# EasyEDA schematic SCH_EVTY_2024-05-09.json
TITLE: EVTY_V1; REV: 1.0; Date: 2024-05-09; Sheet: 1/1; Drawn By: M Aitesam; Company: Tachyon
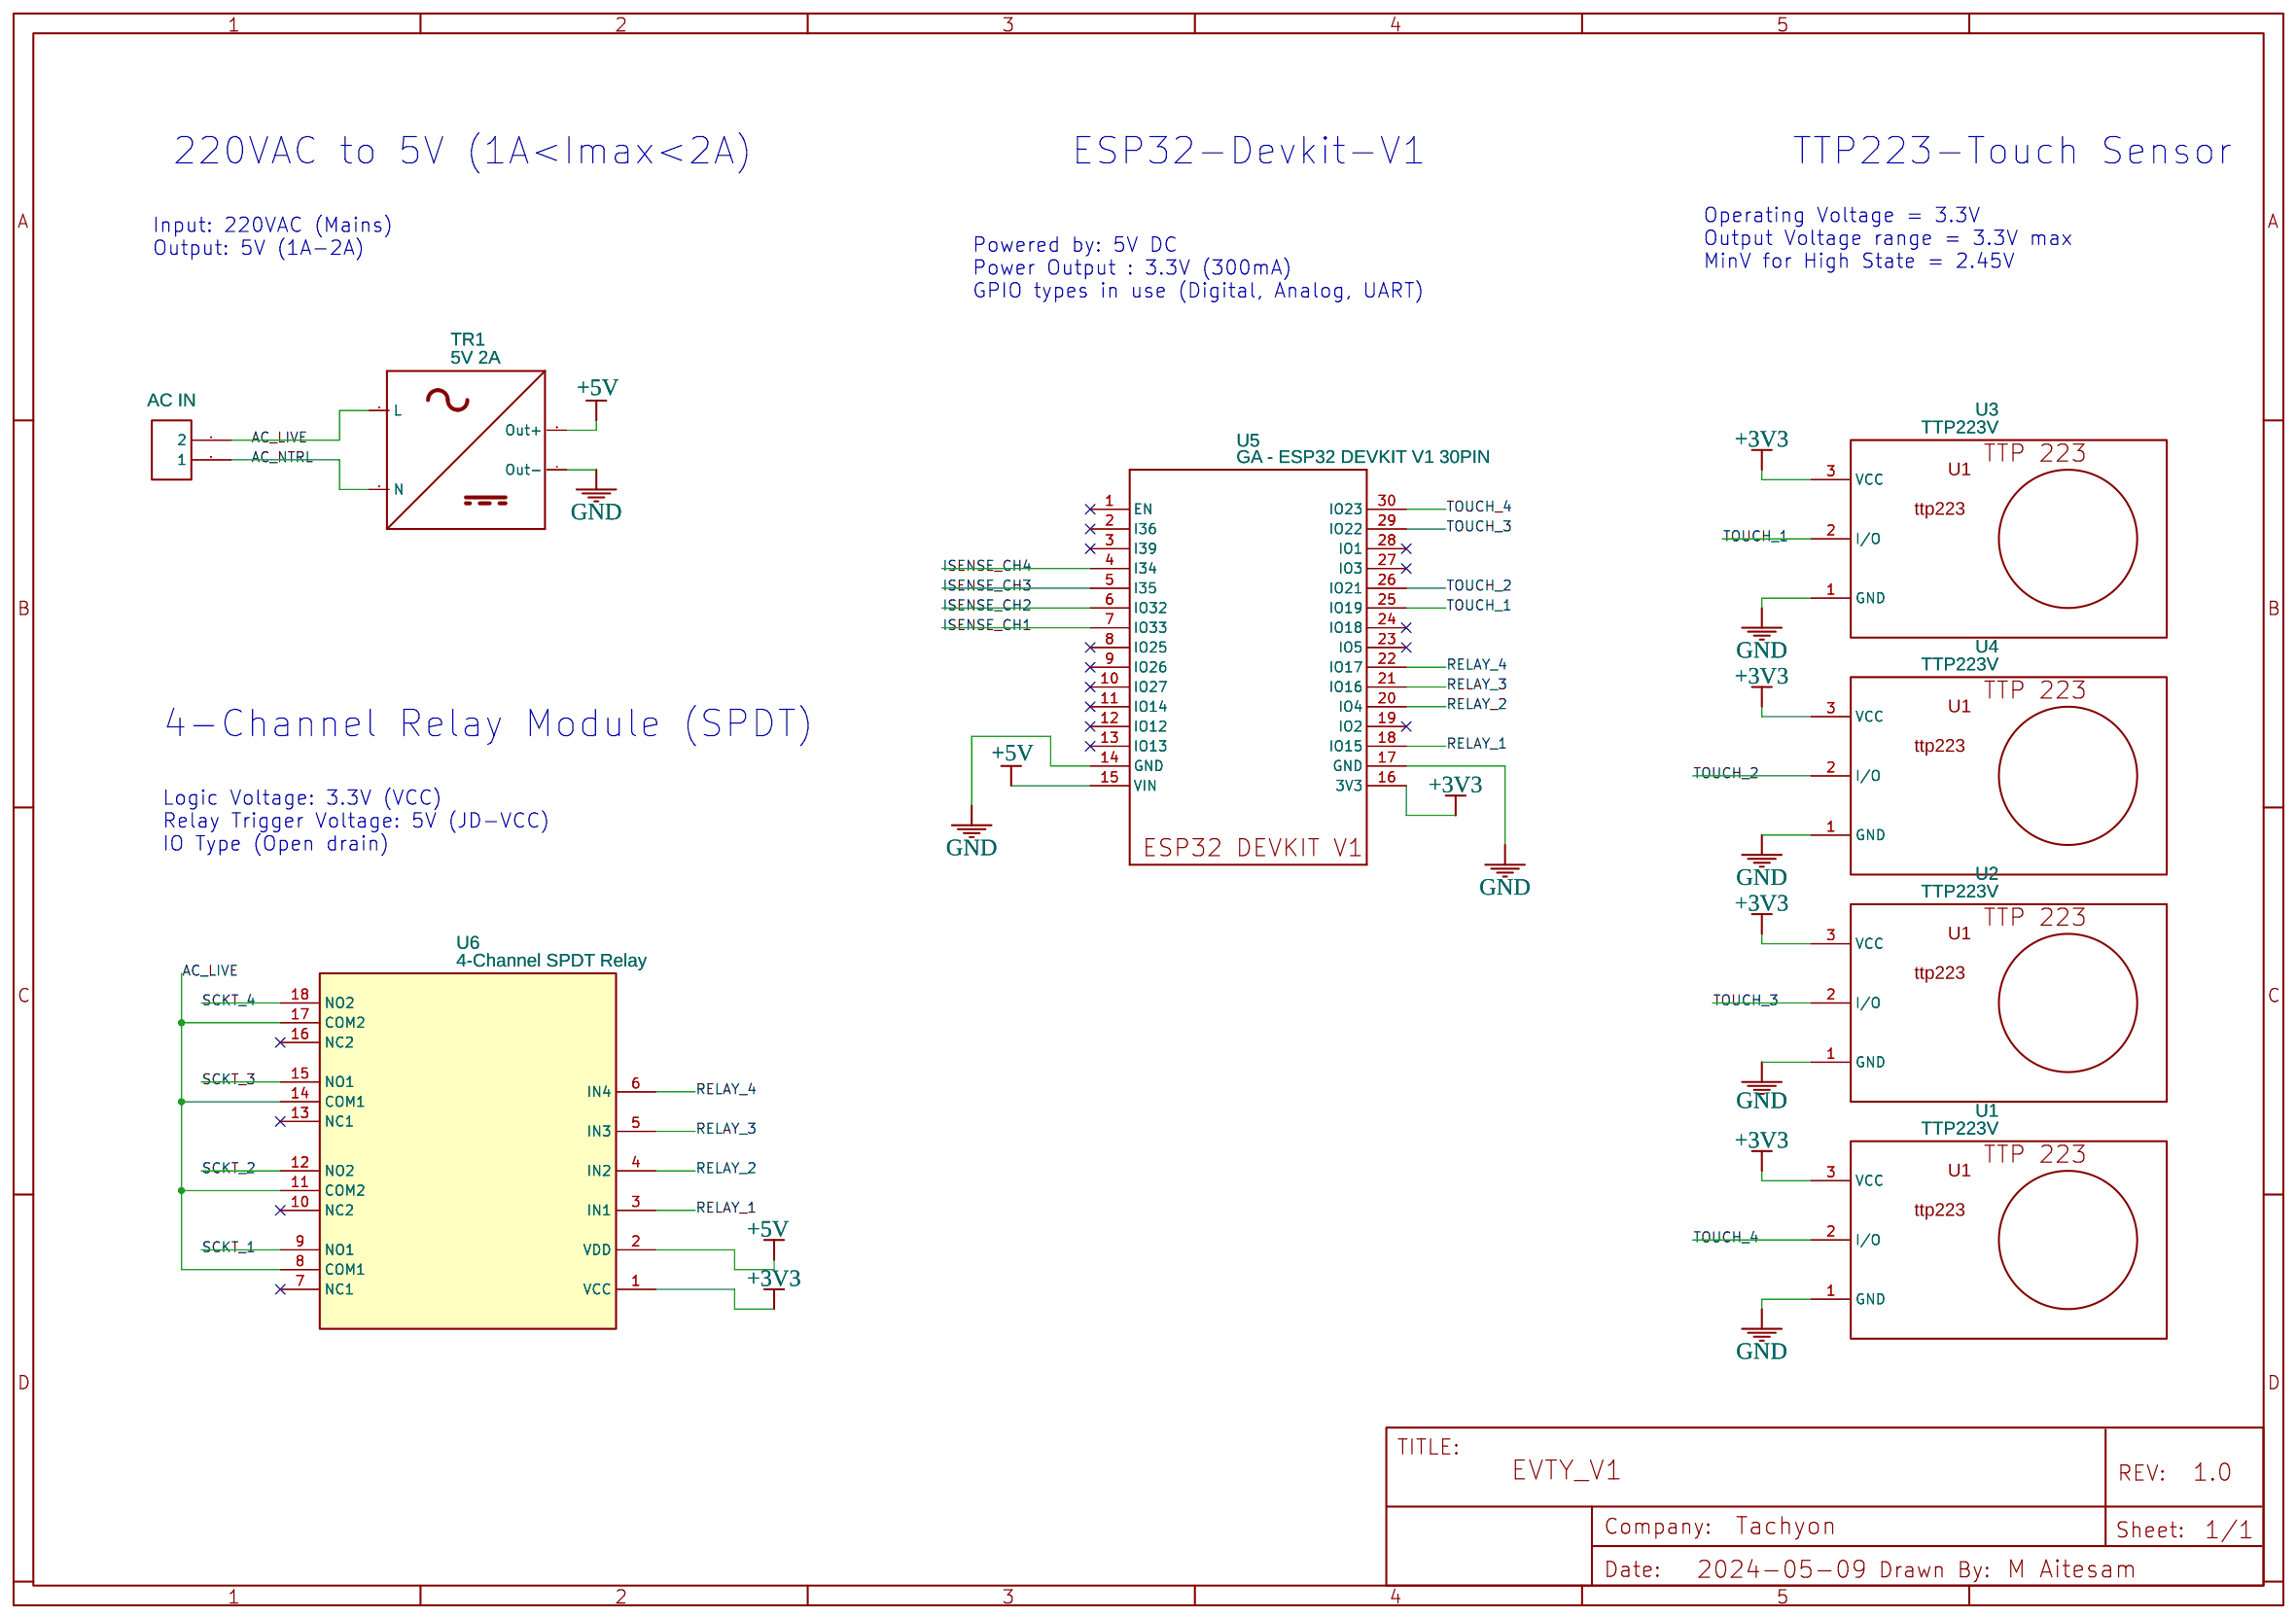
[diagram p0: schematic sheet]

## Parts
OUT1  AC IN  [CONN-TH_2P-P3.96_3961S-2P]
TR1  5V 2A  [0]
U1  TTP223V  [TTP223V]
U2  TTP223V  [TTP223V]
U3  TTP223V  [TTP223V]
U4  TTP223V  [TTP223V]
U5  GA - ESP32 DEVKIT V1 30PIN  [ESP32-DEVKITV1_ESP32-DEVKITV1]
U6  4-Channel SPDT Relay  [BASIC 2-CHANNEL SPDT RELAY CARRIER WITH 5VDC RELAYS]

## Library data of the parts
OUT1 = 2_pin_RELIMATE: Manufacturer Part: RELIMATE CON 3 PIN; Contributor: Harikrishnan K M
TR1 = AC_DC_adapter: MYRRA 47202 ACDC PCB Mount Power Supply, Switch Mode, Fixed, 1 Output; Contributor: VazquezRogadoD
U1-U4 = TTP223V: Contributor: vajapravin23
U5 = ESP32-DEVKIT-V1-30PIN: Contributor: GERMAN ATALA; Supplier: Космодром
U6 = Basic 4-Channel SPDT Relay Carrier with 5VDC Relays: Contributor: tonypitzing; sourceId: YsmgyP7pj; Manufacturer Part: MF-6402393; Manufacturer: MAKERFACTORY; link: https://www.conrad.de/de/p/makerfactory-mf-6402393-relais-modul-1-st-2134131.html?searchType=SearchRedirect

## Nets
+3V3: U1.3(VCC) U2.3(VCC) U3.3(VCC) U4.3(VCC) U5.16(3V3) U6.1(VCC)
+5V: TR1.3(Out+) U5.15(VIN) U6.2(VDD)
GND: TR1.4(Out-) U1.1(GND) U2.1(GND) U3.1(GND) U4.1(GND) U5.14(GND) U5.17(GND)
AC_LIVE: OUT1.2 TR1.1(L) U6.8(COM1) U6.11(COM2) U6.14(COM1) U6.17(COM2)
AC_NTRL: OUT1.1 TR1.2(N)
ISENSE_CH1: U5.7(IO33)
ISENSE_CH2: U5.6(IO32)
ISENSE_CH3: U5.5(I35)
ISENSE_CH4: U5.4(I34)
RELAY_1: U5.18(IO15) U6.3(IN1)
RELAY_2: U5.20(IO4) U6.4(IN2)
RELAY_3: U5.21(IO16) U6.5(IN3)
RELAY_4: U5.22(IO17) U6.6(IN4)
SCKT_1: U6.9(NO1)
SCKT_2: U6.12(NO2)
SCKT_3: U6.15(NO1)
SCKT_4: U6.18(NO2)
TOUCH_1: U3.2(I/O) U5.25(IO19)
TOUCH_2: U4.2(I/O) U5.26(IO21)
TOUCH_3: U2.2(I/O) U5.29(IO22)
TOUCH_4: U1.2(I/O) U5.30(IO23)

Not connected (* = marked no-connect by the designer): U5 1(EN)* 2(I36)* 3(I39)* 8(IO25)* 9(IO26)* 10(IO27)* 11(IO14)* 12(IO12)* 13(IO13)* 19(IO2)* 23(IO5)* 24(IO18)* 27(IO3)* 28(IO1)*; U6 7(NC1)* 10(NC2)* 13(NC1)* 16(NC2)*

## Notes on the sheet
- 220VAC to 5V (1A<Imax<2A)
- ESP32-Devkit-V1
- TTP223-Touch Sensor
- Operating Voltage = 3.3V
  Output Voltage range = 3.3V max
  MinV for High State = 2.45V
- Input: 220VAC (Mains)
  Output: 5V (1A-2A)
- Powered by: 5V DC
  Power Output : 3.3V (300mA)
  GPIO types in use (Digital, Analog, UART)
- 4-Channel Relay Module (SPDT)
- Logic Voltage: 3.3V (VCC)
  Relay Trigger Voltage: 5V (JD-VCC)
  IO Type (Open drain)
